# Altium schematic sheet Filter_L.SchDoc: Filter_L
size A3; SheetNumber: 2; SheetTotal: 5
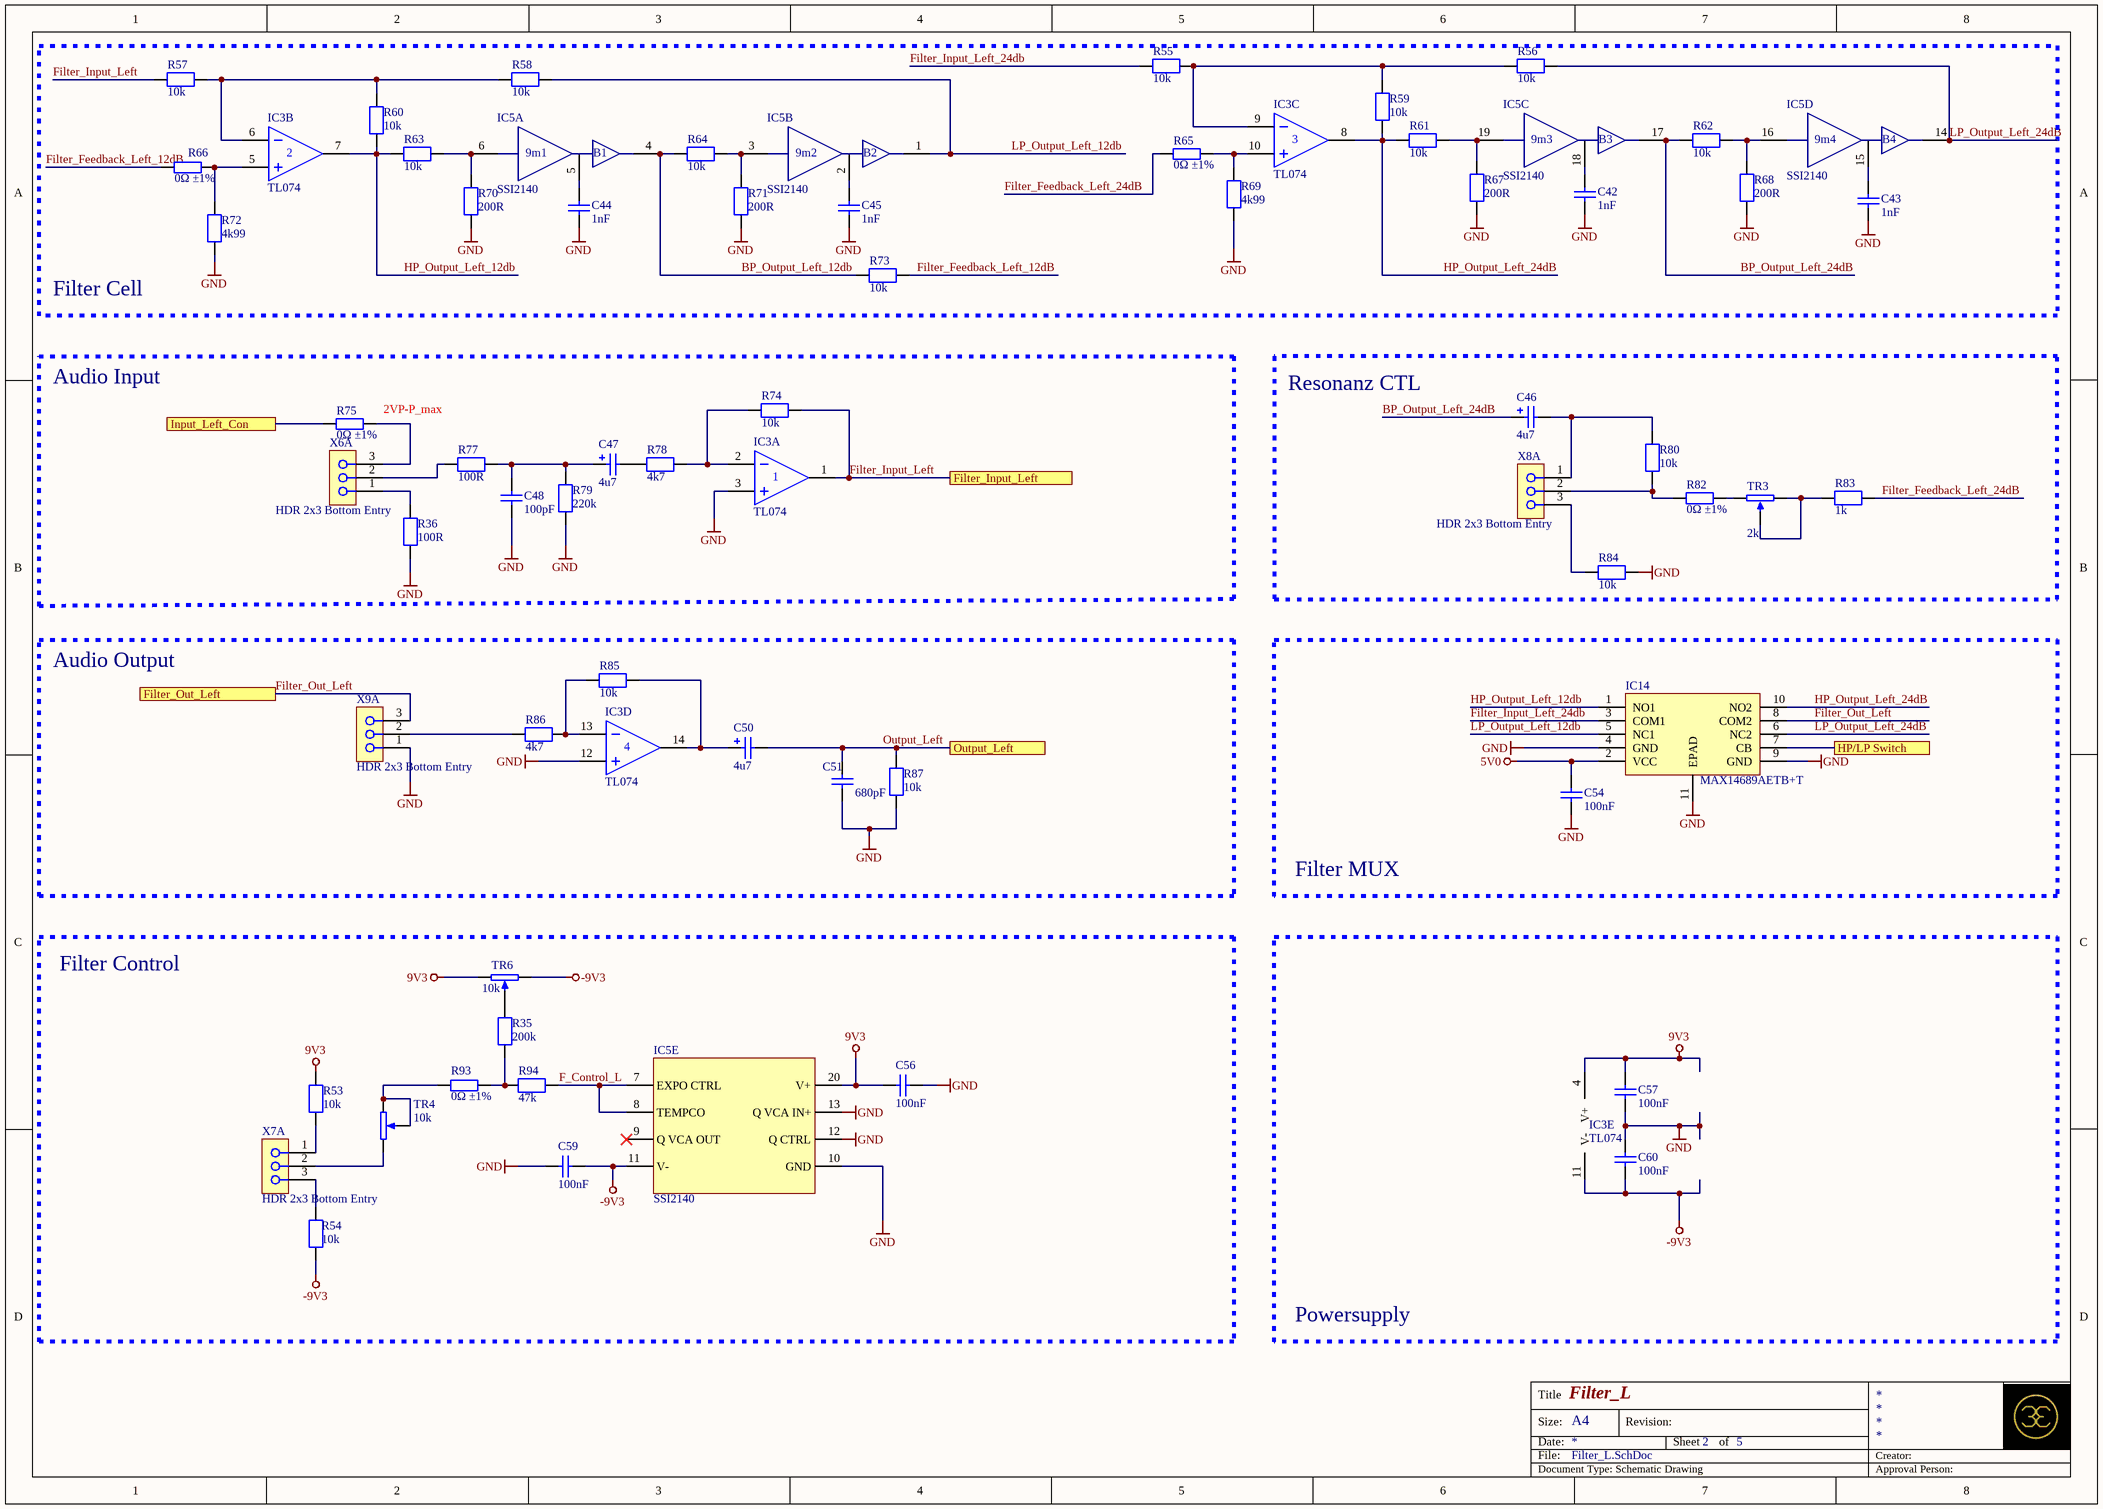
[diagram p0: Filter_L.SchDoc]

## Parts
C42  1nF  [CAPC2012X145N]  (no BOM)
C43  1nF  [CAPC2012X145N]  (no BOM)
C44  1nF  [CAPC2012X145N]  (no BOM)
C45  1nF  [CAPC2012X145N]  (no BOM)
C46  4u7  [CAPAE4643X54M]
C47  4u7  [CAPAE4643X54M]
C48  100pF  [CAPC2012X145N]
C50  4u7  [CAPAE4643X54M]
C51  680pF  [CAPC2012X145N]
C54  100nF  [CAPC1608X95N]
C56  100nF  [CAPC1608X95N]
C57  100nF  [CAPC1608X95N]
C59  100nF  [CAPC1608X95N]
C60  100nF  [CAPC1608X95N]
IC3  TL074  [SOIC127P600X175-14N]  (parts A,B,C,D,E of 5)
IC5  SSI2140  [SOP65P650-20N]  (parts A,B,C,D,E of 5)
IC14  MAX14689AETB+T  [QFN40P200X250X80_HS-11N]
R35  200k  [RESC2012X70N]
R36  100R  [RESC2012X70N]
R53  10k  [RESC2012X70N]
R54  10k  [RESC2012X70N]
R55  10k  [RESC2012X70N]
R56  10k  [RESC2012X70N]
R57  10k  [RESC2012X70N]
R58  10k  [RESC2012X70N]
R59  10k  [RESC2012X70N]
R60  10k  [RESC2012X70N]
R61  10k  [RESC2012X70N]
R62  10k  [RESC2012X70N]
R63  10k  [RESC2012X70N]
R64  10k  [RESC2012X70N]
R65  0Ω ±1%  [RESC2012X70N]
R66  0Ω ±1%  [RESC2012X70N]
R67  200R  [RESC2012X70N]
R68  200R  [RESC2012X70N]
R69  4k99  [RESC2012X70N]
R70  200R  [RESC2012X70N]
R71  200R  [RESC2012X70N]
R72  4k99  [RESC2012X70N]
R73  10k  [RESC2012X70N]
R74  10k  [RESC2012X70N]
R75  0Ω ±1%  [RESC2012X70N]
R77  100R  [RESC2012X70N]
R78  4k7  [RESC2012X70N]
R79  220k  [RESC2012X70N]
R80  10k  [RESC2012X70N]
R82  0Ω ±1%  [RESC2012X70N]
R83  1k  [RESC2012X70N]
R84  10k  [RESC2012X70N]
R85  10k  [RESC2012X70N]
R86  4k7  [RESC2012X70N]
R87  10k  [RESC2012X70N]
R93  0Ω ±1%  [RESC2012X70N]
R94  47k  [RESC2012X70N]
TR3  2k  [PVG3G503C01R00]
TR4  10k  [3296Y]
TR6  10k  [3296Y]
X6  HDR 2x3 Bottom Entry  [613006216921-poti]  (part A of 2)
X7  HDR 2x3 Bottom Entry  [613006216921-poti]  (part A of 2)
X8  HDR 2x3 Bottom Entry  [613006216921-poti]  (part A of 2)
X9  HDR 2x3 Bottom Entry  [613006216921-poti]  (part A of 2)

## Blocks framed on the sheet
Filter Cell: C42-C45 IC3 IC5 R55-R73
Audio Input: C47 C48 IC3 R36 R74 R75 R77-R79 X6
Resonanz CTL: C46 R80 R82-R84 TR3 X8
Audio Output: C50 C51 IC3 R85-R87 X9
Filter MUX: C54 IC14
Filter Control: C56 C59 IC5 R35 R53 R54 R93 R94 TR4 TR6 X7
Powersupply: C57 C60 IC3

## Ports
Filter_Input_Left, Filter_Out_Left, HP/LP Switch, Input_Left_Con, Output_Left

## Nets
5V0: C54.2 IC14.2(VCC)
9V3: C56.1 C57.2 IC3.4(V+) IC5.20(V+) R53.2 TR6.1
-9V3: C59.2 C60.1 IC3.11(V-) IC5.11(V-) R54.1 TR6.3
GND: C42.1 C43.1 C44.1 C45.1 C48.1 C51.1 C54.1 C56.2 C57.1 C59.1 C60.2 IC3.3(IN+) IC3.12(IN+) IC5.10(GND) IC5.12(Q_CTRL) IC5.13(Q_VCA_IN+) IC14.4(GND) IC14.9(GND) IC14.11(EPAD) R36.1 R67.1 R68.1 R69.1 R70.1 R71.1 R72.1 R79.1 R84.2 R87.1 X9.1
BP_Output_Left_12db: IC5.4(OUT_1) R64.1 R73.1
BP_Output_Left_24dB: C46.1 IC5.17(OUT_3) R62.1
F_Control_L: IC5.7(EXPO_CTRL) IC5.8(TEMPCO) R94.2
Filter_Feedback_Left_12dB: R66.1 R73.2
Filter_Feedback_Left_24dB: R65.1 R83.1
Filter_Input_Left: IC3.1(OUT) R57.1 R74.1 ; port Filter_Input_Left
Filter_Input_Left_24db: IC14.3(COM1) R55.2
Filter_Out_Left: IC14.8(COM2) X9.3 ; port Filter_Out_Left
HP/LP Switch: IC14.7(CB) ; port HP/LP Switch
HP_Output_Left_12db: IC3.7(OUT) IC14.1(NO1) R60.1 R63.1
HP_Output_Left_24dB: IC3.8(OUT) IC14.10(NO2) R59.1 R61.1
Input_Left_Con: R75.1 ; port Input_Left_Con
LP_Output_Left_12db: IC5.1(OUT_2) IC14.5(NC1) R58.2
LP_Output_Left_24dB: IC5.14(OUT_4) IC14.6(NC2) R56.2
Output_Left: C50.2 C51.2 R87.2 ; port Output_Left
NetC42_2: C42.2 IC5.18(CAP_3)
NetC43_2: C43.2 IC5.15(CAP_4)
NetC44_2: C44.2 IC5.5(CAP_1)
NetC45_2: C45.2 IC5.2(CAP_2)
NetC46_2: C46.2 R80.2 X8.1
NetC47_1: C47.1 C48.2 R77.2 R79.2
NetC47_2: C47.2 R78.2
NetC50_1: C50.1 IC3.14(OUT) R85.1
NetIC3_2: IC3.2(IN-) R74.2 R78.1
NetIC3_5: IC3.5(IN+) R66.2 R72.2
NetIC3_6: IC3.6(IN-) R57.2 R58.1 R60.2
NetIC3_9: IC3.9(IN+) R55.1 R56.1 R59.2
NetIC3_10: IC3.10(IN-) R65.2 R69.2
NetIC3_13: IC3.13(IN-) R85.2 R86.1
NetIC5_3: IC5.3(IN_2) R64.2 R71.2
NetIC5_6: IC5.6(IN_1) R63.2 R70.2
NetIC5_16: IC5.16(IN_4) R62.2 R68.2
NetIC5_19: IC5.19(IN_3) R61.2 R67.2
NetR35_1: R35.1 R93.2 R94.1
NetR35_2: R35.2 TR6.2
NetR36_2: R36.2 X6.1
NetR53_1: R53.1 X7.1
NetR54_2: R54.2 X7.3
NetR75_2: R75.2 X6.3
NetR77_1: R77.1 X6.2
NetR80_1: R80.1 R82.1 X8.2
NetR82_2: R82.2 TR3.1
NetR83_2: R83.2 TR3.2 TR3.3
NetR84_1: R84.1 X8.3
NetR86_2: R86.2 X9.2
NetR93_1: R93.1 TR4.2 TR4.3
NetTR4_1: TR4.1 X7.2

Not connected (* = marked no-connect by the designer): IC5 9(Q_VCA_OUT)*

## Notes on the sheet
- (near R75) 2VP-P_max
- Title
- Size:
- Date:
- File:
- A4
- Revision:
- Sheet
- of
- Creator:
- Document Type: Schematic Drawing
- Approval Person:
- (in symbol IC_SSI2140, part A) 9m1; B1
- (in symbol IC_SSI2140, part B) 9m2; B2
- (in symbol IC_SSI2140, part C) 9m3; B3
- (in symbol IC_SSI2140, part D) 9m4; B4

## Library data of the parts
C42 C44 = CAP_1nF_630V: Multilayer Ceramic Capacitors MLCC - SMD/SMT, C0G(NP0), 100nF; Manufacturer: Murata Electronics; Manufacturer Part Number: GRM21B5C2J102JWA3L; Voltage Rating: 630VDC; Tolerance: 5%; Alternatives allowed: yes
C43 C45 = CAP_100nF_630V: Multilayer Ceramic Capacitors MLCC - SMD/SMT, C0G(NP0), 1nF; Manufacturer: Murata Electronics; Manufacturer Part Number: GRM21B5C2J102JWA3L; Voltage Rating: 630VDC; Tolerance: 5%; Alternatives allowed: yes
C46 C47 C50 = CAP_4u7: Aluminium Electrolytic Capacitors - SMD 4.7UF 16V ELECT VS BI-POLAR; Manufacturer: Panasonic; Manufacturer Part Number: EEE-1CA4R7NR; Tolerance: 20%; Alternatives allowed: NO; Voltage Rating: 16V
C48 = CAP_100pF_0805: Film Capacitors 100pF 50VDC 2% PPS FILM 0805; Manufacturer: Panasonic; Manufacturer Part Number: ECH-U1H101GX5; Voltage Rating: 50V; Alternatives allowed: NO; Tolerance: 2%
C51 = CAP_680pF_0805: Film Capacitors 680pF 50VDC 2% PPS FILM 0805; Manufacturer: Panasonic; Manufacturer Part Number: ECH-U1H681GX5; Voltage Rating: 50V; Alternatives allowed: NO; Tolerance: 2%
C54 C56 C57 C59 C60 = CAP_100nF_0603: Multilayer Ceramic Capacitors MLCC - SMD/SMT, 100nF; Manufacturer: YAGEO; Manufacturer Part Number: CC0603KRX7R9BB104; Voltage Rating: 50VDC; Tolerance: 10%; Alternatives allowed: yes; JLC: C14663
IC3 = IC_TL074: Operational Amplifiers - Op Amps Dual JFET Op Amp; Manufacturer: Texas Instruments; Manufacturer Part Number: TL074CDR; Alternatives allowed: NO
IC5 = IC_SSI2140: Voltage Controlled Multi-Mode Filter; Manufacturer: Sound Semiconductor; Alternatives allowed: NO; Manufacturer Part Number: SSI2140; JLC: *
IC14 = IC_MAX14689AETB+T: Analogue Switch ICs Ultra-Small, Low-RON, Beyond-the-Rails™, DPDT Analog Switches; Manufacturer: Maxim Integrated; Alternatives allowed: NO; Manufacturer Part Number: MAX14689AETB+T
R35 = RES_200k_0805: Thick Film Resistors - SMD 1/8watt 200Kohms 1%; Manufacturer: Vishay / Dale; Manufacturer Part Number: CRCW0805200KFKEA; Voltage Rating: 150V; Alternatives allowed: YES; Tolerance: 1%; JLC: C17539
R36 R77 = RES_100R_0805: Thick Film Resistors 1/8watt 100ohms 1% 100ppm; Manufacturer: Vishay / Dale; Manufacturer Part Number: CRCW0805100RFKEA; Voltage Rating: 150V; Alternatives allowed: YES; Tolerance: 1%; JLC: C17408
R53 R55-R64 R73 R74 R80 R85 R87 = RES_10k_0805: Thick Film Resistors - SMD 1/8watt 10Kohms 1% 100ppm; Manufacturer: Vishay / Dale; Manufacturer Part Number: CRCW080510K0FKEA; Voltage Rating: 150V; Alternatives allowed: YES; Tolerance: 1%; JLC: C17414
R54 R84 = RES_10k_0805: Thick Film Resistors - SMD 1/8watt 10Kohms 1% 100ppm; Manufacturer Part Number: CRCW080510K0FKEA; Manufacturer: Vishay / Dale; Alternatives allowed: YES; Voltage Rating: 150V; Tolerance: 1%; JLC: C17414
R65 R66 R75 R82 R93 = 0805 0R (0R0) 1%: Chip resistor; Manufacturer Part Number: CRCW08050000Z0EAC; Manufacturer: Vishay / Dale; Alternatives allowed: YES; Tolerance: 1%; JLC: C17477
R67 R68 R70 R71 = RES_200R_0805: Thick Film Resistors - SMD 1/8watt 200ohms 1% 100ppm; Manufacturer: Vishay / Dale; Manufacturer Part Number: CRCW0805200RFKEA; Voltage Rating: 150V; Alternatives allowed: YES; Tolerance: 1%; JLC: C17540
R69 R72 = RES_4k99_0805: Thick Film Resistors - SMD 1/8watt 4.99Kohms 1% 100ppm; Manufacturer: Vishay / Dale; Manufacturer Part Number: CRCW08054K99FKEA; Voltage Rating: 150V; Alternatives allowed: YES; Tolerance: 1%; JLC: C17677
R78 R86 = RES_4k7_0805: Thick Film Resistors - SMD 1/8Watt 4.7Kohms 1% Commercial Use; Manufacturer: Vishay / Dale; Manufacturer Part Number: CRCW08054K70FKEAC; Voltage Rating: 150V; Alternatives allowed: YES; Tolerance: 1%; JLC: C17673
R79 = RES_220k_0805: Thick Film Resistors - SMD 1/8watt 220Kohms 1%; Manufacturer: Vishay / Dale; Manufacturer Part Number: CRCW0805220KFKEA; Voltage Rating: 150V; Alternatives allowed: YES; Tolerance: 1%; JLC: C17556
R83 = RES_1k_0805: Thick Film Resistors - SMD 1/8watt 1Kohms 1% 100ppm; Manufacturer: Vishay / Dale; Manufacturer Part Number: CRCW08051K00FKEA; Voltage Rating: 150V; Alternatives allowed: YES; Tolerance: 1%; JLC: C17513
R94 = RES_47k_0805: Thick Film Resistors - SMD 1/8watt 47Kohms 1%; Manufacturer: Vishay / Dale; Manufacturer Part Number: CRCW080547K0FKEB; Voltage Rating: 150V; Alternatives allowed: YES; Tolerance: 1%; JLC: C17713
TR3 = TRIM_2k_lin: Trimmer Resistors - SMD 2.0Kohms Sealed 3mm Sngl turn; Manufacturer: Bourns; Manufacturer Part Number: PVG3A202C01R00; Tolerance: 20%
TR4 TR6 = TRIM_10k_lin_25: 10 kOhms 0.5W, 1/2W PC Pins Through Hole Trimmer Potentiometer Cermet 25.0 Turn Top Adjustment; Manufacturer: Bourns; Manufacturer Part Number: 3296Y-1-103LF; Tolerance: 10%
X6-X9 = CON_SOCKET_2x3_Poti: Printbuchse, Einführung unten, Board-to-Board, 2.54 mm, 2 Reihe(n), 4 Kontakt(e), Durchsteckmontage; Manufacturer: WE; Manufacturer Part Number: 613004216921; Alternatives allowed: YES